# EasyEDA schematic HAM-VL_V1.5.json
TITLE: Dead Bug; REV: 1.4; Date: 2025-03-19; Sheet: 1/1; Drawn By: Huy T Huong; Company: UB Extreme Environments Lab
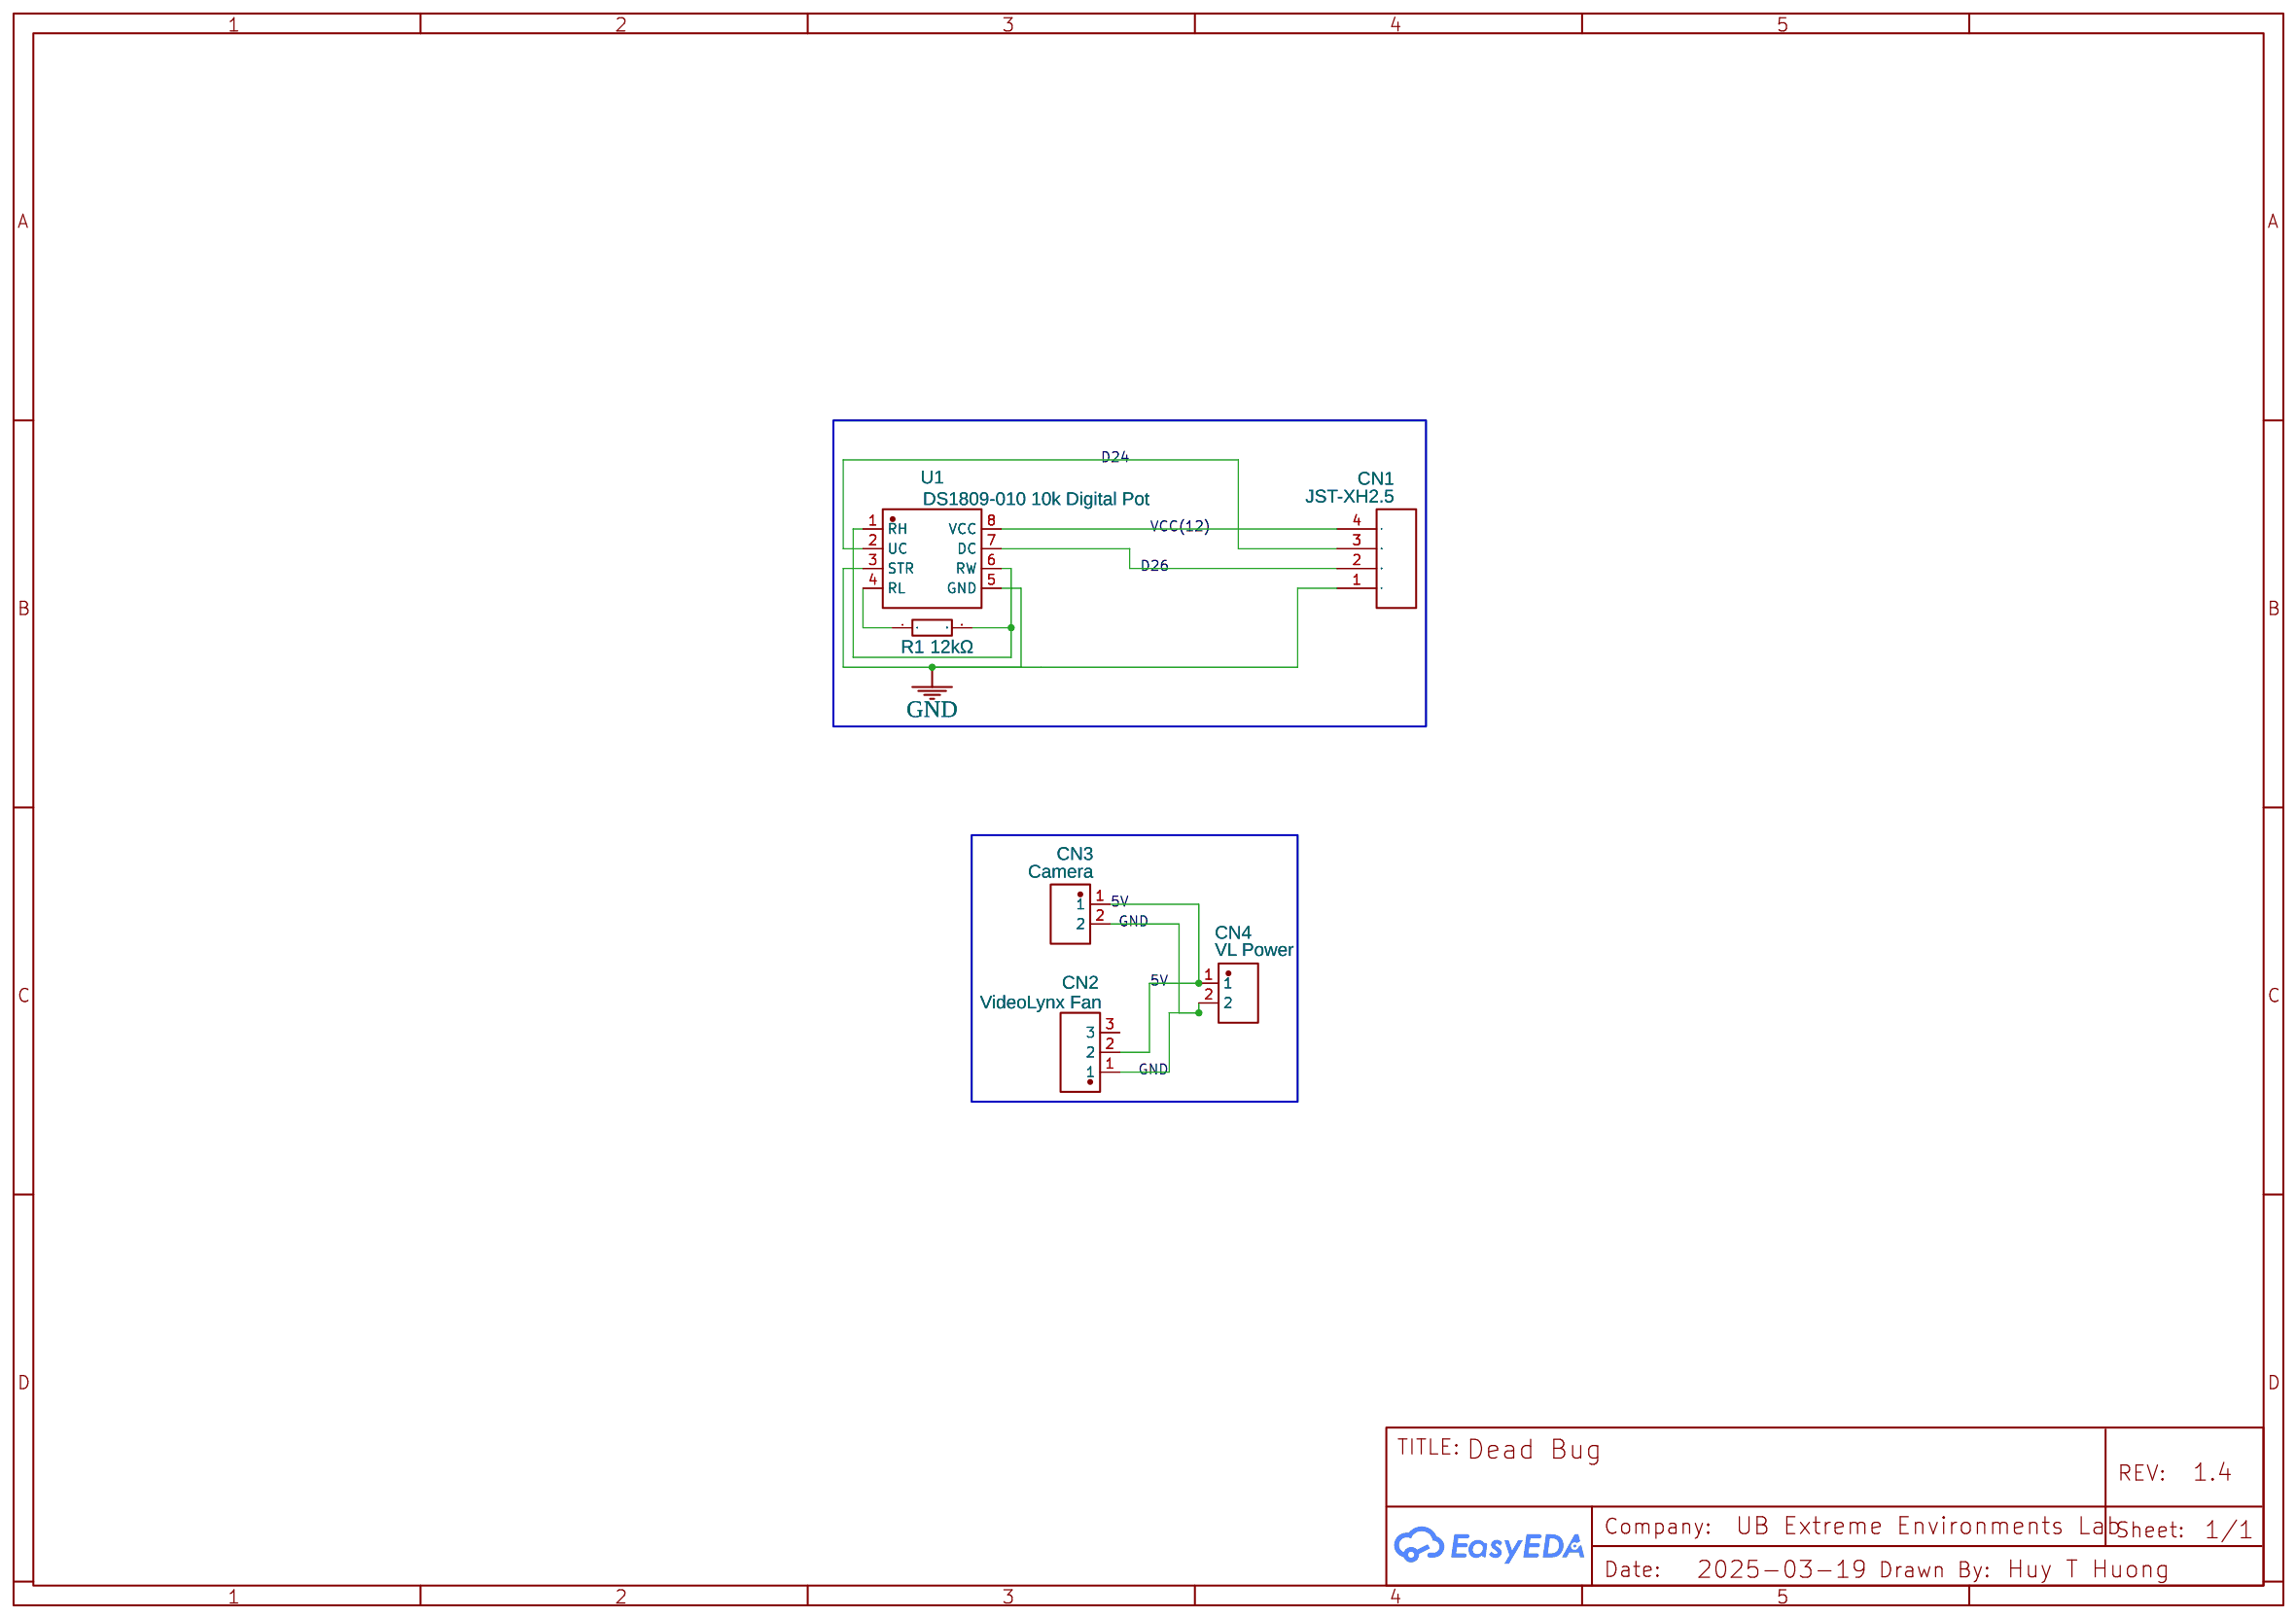
[diagram p0: schematic sheet]

## Parts
CN1  JST-XH2.5  [4PIN_2.54_MM_JST_XHP_JST_CONNECTOR_FOR_DC_SOCKET]
CN2  VideoLynx Fan  [CONN-TH_C722693]
CN3  Camera  [CONN-TH_2P-P2.50-XH2.54-2P]
CN4  VL Power  [CONN-TH_2P-P2.50-XH2.54-2P]
R1  12kΩ  [RES-TH_BD2.2-L6.5-P10.50-D0.6]
U1  DS1809-010 10k Digital Pot  [PDIP-8_L9.3-W6.4-P2.54-LS7.6-BL]

## Library data of the parts
CN1 = JST-XH2.54- 4 PIN Y COPY: Contributor: moorpcbs
CN2 = XH插座1*3P间距2.5MM直针,: Contributor: lcsc; Supplier: LCSC; Supplier Part: C9900015994; Manufacturer: null; Manufacturer Part: XH插座1*3P间距2.5mm直针,; JLCPCB Part Class: Extended Part
CN3 CN4 = XH-2P-2.54: Contributor: LCSC; Convert to PCB: Yes; Add into BOM: Yes; Supplier: LCSC; Supplier Part: C9900003929; Manufacturer: null; JLCPCB Part Class: Extended Part
R1 = MFR-25FTE52-12K: Contributor: LCSC; Supplier: LCSC; Manufacturer: YAGEO(国巨); Supplier Part: C138213; JLCPCB Part Class: Extended Part
U1 = DS1809-010+: Contributor: LCSC; Supplier: LCSC; Supplier Part: C1520933; Manufacturer: ADI(亚德诺)/MAXIM(美信); JLCPCB Part Class: Extended Part

## Nets
5V: CN2.2 CN3.1 CN4.1
GND: CN1.1 CN2.1 CN3.2 CN4.2 U1.3(STR) U1.5(GND)
VCC(12): CN1.4 U1.8(VCC)
D24: CN1.3 U1.2(UC)
D26: CN1.2 U1.7(DC)
Net-(R1-1): R1.1 U1.4(RL)
Net-(R1-2): R1.2 U1.1(RH) U1.6(RW)

Not connected (* = marked no-connect by the designer): CN2 3
